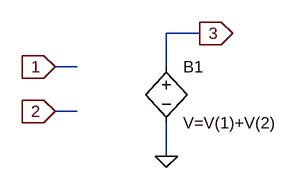
[diagram p0: schematic adder.asc]
adder.asc, the LTspice schematic file:
Version 4
SHEET 1 880 680
WIRE 176 64 128 64
WIRE 0 112 -32 112
WIRE 128 112 128 64
WIRE 0 176 -32 176
WIRE 128 240 128 192
FLAG -32 112 1
IOPIN -32 112 In
FLAG -32 176 2
IOPIN -32 176 In
FLAG 128 240 0
FLAG 176 64 3
IOPIN 176 64 Out
SYMBOL bv 128 96 R0
SYMATTR InstName B1
SYMATTR Value V=V(1)+V(2)

The netlist it stands for:
* adder.asc
B1 3 0 V=V(1)+V(2)
.backanno
.end